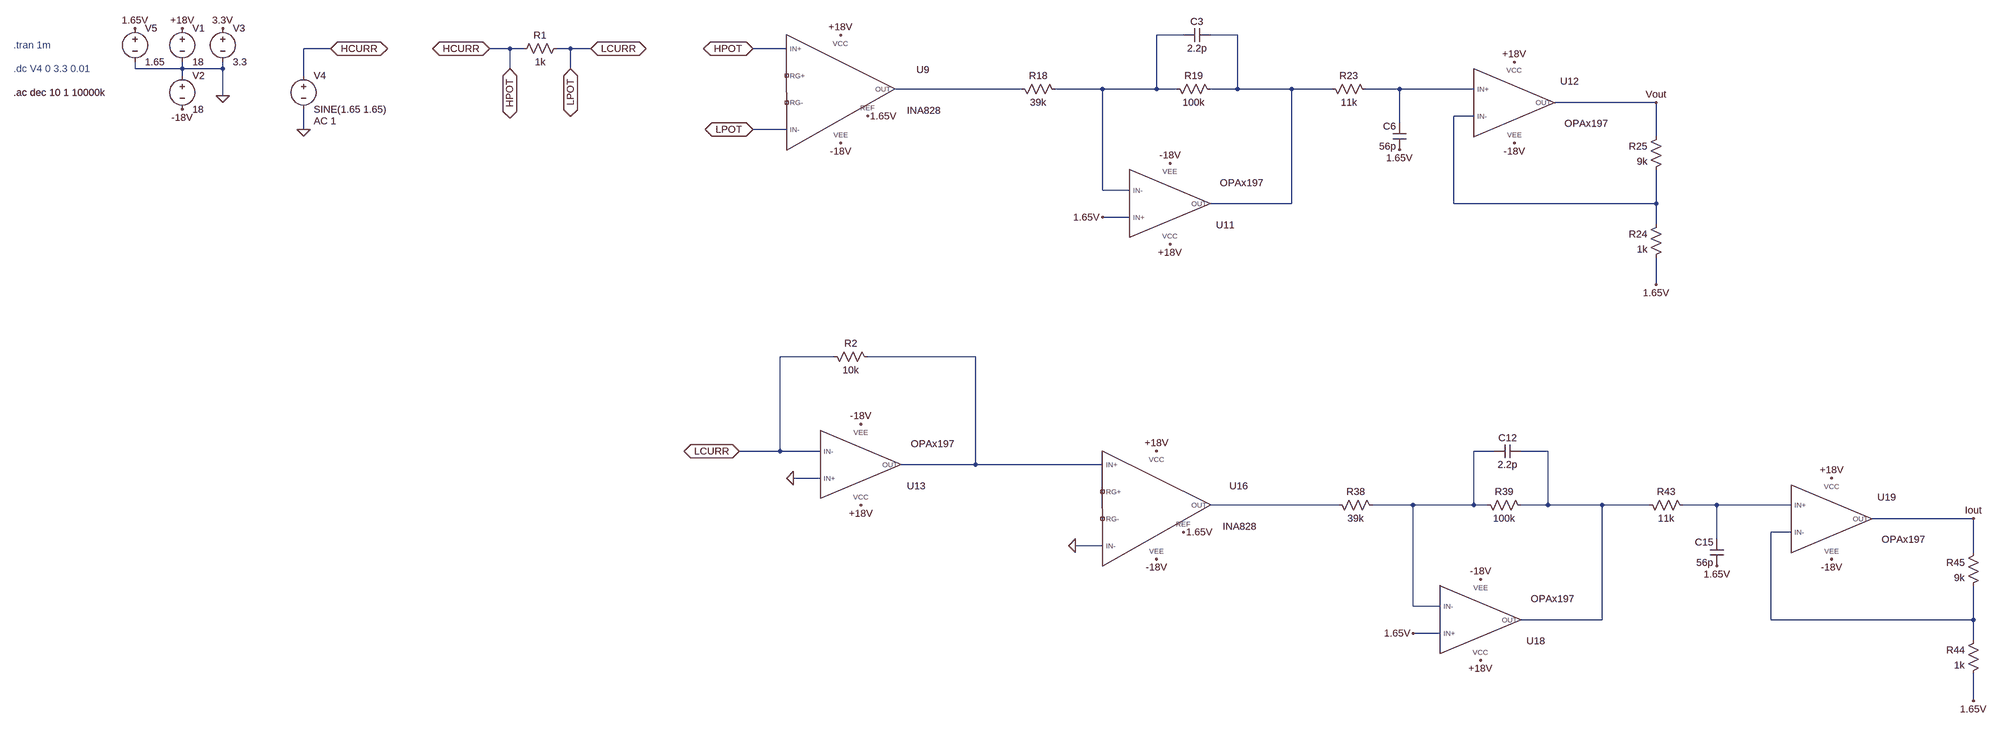
[diagram p0: schematic partial.asc]
partial.asc, the LTspice schematic file:
Version 4
SHEET 1 3644 5472
WIRE 1712 1344 1648 1344
WIRE 1840 1344 1776 1344
WIRE -448 1376 -512 1376
WIRE 112 1376 64 1376
WIRE 144 1376 112 1376
WIRE 256 1376 224 1376
WIRE 304 1376 256 1376
WIRE 768 1376 688 1376
WIRE -1088 1424 -1088 1408
WIRE -976 1424 -976 1408
WIRE -976 1424 -1088 1424
WIRE -880 1424 -880 1408
WIRE -880 1424 -976 1424
WIRE 112 1424 112 1376
WIRE 256 1424 256 1376
WIRE -976 1440 -976 1424
WIRE -512 1440 -512 1376
WIRE 1328 1472 1024 1472
WIRE 1520 1472 1408 1472
WIRE 1648 1472 1648 1344
WIRE 1648 1472 1520 1472
WIRE 1696 1472 1648 1472
WIRE 1840 1472 1840 1344
WIRE 1840 1472 1776 1472
WIRE 1968 1472 1840 1472
WIRE 2064 1472 1968 1472
WIRE 2224 1472 2144 1472
WIRE 2400 1472 2224 1472
WIRE -880 1488 -880 1424
WIRE 2832 1504 2592 1504
WIRE 2400 1536 2352 1536
WIRE 2224 1552 2224 1472
WIRE -512 1568 -512 1520
WIRE 768 1568 688 1568
WIRE 2832 1584 2832 1504
WIRE 1520 1712 1520 1472
WIRE 1584 1712 1520 1712
WIRE 1968 1744 1968 1472
WIRE 1968 1744 1776 1744
WIRE 2352 1744 2352 1536
WIRE 2832 1744 2832 1664
WIRE 2832 1744 2352 1744
WIRE 1584 1776 1520 1776
WIRE 2832 1792 2832 1744
WIRE 2832 1936 2832 1872
WIRE 880 2512 752 2512
WIRE 1216 2512 960 2512
WIRE 752 2736 752 2512
WIRE 752 2736 656 2736
WIRE 848 2736 752 2736
WIRE 2448 2736 2400 2736
WIRE 2576 2736 2512 2736
WIRE 1216 2768 1216 2512
WIRE 1216 2768 1040 2768
WIRE 1520 2768 1216 2768
WIRE 848 2800 784 2800
WIRE 2080 2864 1776 2864
WIRE 2256 2864 2160 2864
WIRE 2400 2864 2400 2736
WIRE 2400 2864 2256 2864
WIRE 2432 2864 2400 2864
WIRE 2576 2864 2576 2736
WIRE 2576 2864 2512 2864
WIRE 2704 2864 2576 2864
WIRE 2816 2864 2704 2864
WIRE 2976 2864 2896 2864
WIRE 3152 2864 2976 2864
WIRE 3584 2896 3344 2896
WIRE 3152 2928 3104 2928
WIRE 2976 2944 2976 2864
WIRE 1520 2960 1456 2960
WIRE 3584 2976 3584 2896
WIRE 2256 3104 2256 2864
WIRE 2320 3104 2256 3104
WIRE 2704 3136 2704 2864
WIRE 2704 3136 2512 3136
WIRE 3104 3136 3104 2928
WIRE 3584 3136 3584 3056
WIRE 3584 3136 3104 3136
WIRE 2320 3168 2256 3168
WIRE 3584 3184 3584 3136
WIRE 3584 3328 3584 3264
FLAG -880 1488 0
FLAG -976 1328 +18V
FLAG -976 1520 -18V
FLAG -880 1328 3.3V
FLAG -448 1376 HCURR
IOPIN -448 1376 BiDir
FLAG 688 1376 HPOT
IOPIN 688 1376 BiDir
FLAG 688 1568 LPOT
IOPIN 688 1568 BiDir
FLAG 896 1600 -18V
FLAG 896 1344 +18V
FLAG 112 1424 HPOT
IOPIN 112 1424 BiDir
FLAG 256 1424 LPOT
IOPIN 256 1424 BiDir
FLAG 1680 1840 +18V
FLAG 1680 1648 -18V
FLAG 1520 1776 1.65V
FLAG 2224 1616 1.65V
FLAG 2496 1408 +18V
FLAG 2496 1600 -18V
FLAG 2832 1504 Vout
FLAG 944 2864 +18V
FLAG 944 2672 -18V
FLAG 656 2736 LCURR
IOPIN 656 2736 BiDir
FLAG 304 1376 LCURR
IOPIN 304 1376 BiDir
FLAG 64 1376 HCURR
IOPIN 64 1376 BiDir
FLAG 1648 2992 -18V
FLAG 1648 2736 +18V
FLAG 2416 3232 +18V
FLAG 2416 3040 -18V
FLAG 2256 3168 1.65V
FLAG 2976 3008 1.65V
FLAG 3248 2800 +18V
FLAG 3248 2992 -18V
FLAG 3584 2896 Iout
FLAG 1712 2928 1.65V
FLAG 784 2800 0
FLAG -512 1568 0
FLAG -1088 1328 1.65V
FLAG 2832 1936 1.65V
FLAG 3584 3328 1.65V
FLAG 1456 2960 0
FLAG 960 1536 1.65V
SYMBOL voltage -976 1312 R0
WINDOW 123 0 0 Left 0
WINDOW 39 0 0 Left 0
SYMATTR InstName V1
SYMATTR Value 18
SYMBOL voltage -976 1424 R0
WINDOW 123 0 0 Left 0
WINDOW 39 0 0 Left 0
SYMATTR InstName V2
SYMATTR Value 18
SYMBOL voltage -880 1312 R0
WINDOW 123 0 0 Left 0
WINDOW 39 0 0 Left 0
SYMATTR InstName V3
SYMATTR Value 3.3
SYMBOL INA828 896 1472 R0
SYMATTR InstName U9
SYMBOL res 1312 1456 M90
WINDOW 0 0 56 VBottom 2
WINDOW 3 32 56 VTop 2
SYMATTR InstName R18
SYMATTR Value 39k
SYMBOL OPAx197 1680 1744 M180
SYMATTR InstName U11
SYMBOL res 1680 1456 M90
WINDOW 0 0 56 VBottom 2
WINDOW 3 32 56 VTop 2
SYMATTR InstName R19
SYMATTR Value 100k
SYMBOL cap 1712 1328 M90
WINDOW 0 0 32 VBottom 2
WINDOW 3 32 32 VTop 2
SYMATTR InstName C3
SYMATTR Value 2.2p
SYMBOL res 2048 1456 M90
WINDOW 0 0 56 VBottom 2
WINDOW 3 32 56 VTop 2
SYMATTR InstName R23
SYMATTR Value 11k
SYMBOL cap 2240 1552 M0
SYMATTR InstName C6
SYMATTR Value 56p
SYMBOL OPAx197 2496 1504 R0
SYMATTR InstName U12
SYMBOL res 2848 1776 M0
SYMATTR InstName R24
SYMATTR Value 1k
SYMBOL res 2848 1568 M0
SYMATTR InstName R25
SYMATTR Value 9k
SYMBOL OPAx197 944 2768 M180
SYMATTR InstName U13
SYMBOL INA828 1648 2864 R0
SYMATTR InstName U16
SYMBOL res 2064 2848 M90
WINDOW 0 0 56 VBottom 2
WINDOW 3 32 56 VTop 2
SYMATTR InstName R38
SYMATTR Value 39k
SYMBOL OPAx197 2416 3136 M180
SYMATTR InstName U18
SYMBOL res 2416 2848 M90
WINDOW 0 0 56 VBottom 2
WINDOW 3 32 56 VTop 2
SYMATTR InstName R39
SYMATTR Value 100k
SYMBOL cap 2448 2720 M90
WINDOW 0 0 32 VBottom 2
WINDOW 3 32 32 VTop 2
SYMATTR InstName C12
SYMATTR Value 2.2p
SYMBOL res 2800 2848 M90
WINDOW 0 0 56 VBottom 2
WINDOW 3 32 56 VTop 2
SYMATTR InstName R43
SYMATTR Value 11k
SYMBOL cap 2992 2944 M0
SYMATTR InstName C15
SYMATTR Value 56p
SYMBOL OPAx197 3248 2896 R0
SYMATTR InstName U19
SYMBOL res 3600 3168 M0
SYMATTR InstName R44
SYMATTR Value 1k
SYMBOL res 3600 2960 M0
SYMATTR InstName R45
SYMATTR Value 9k
SYMBOL voltage -512 1424 R0
WINDOW 123 24 124 Left 2
WINDOW 39 0 0 Left 0
SYMATTR InstName V4
SYMATTR Value SINE(1.65 1.65)
SYMATTR Value2 AC 1
SYMBOL voltage -1088 1312 R0
WINDOW 123 0 0 Left 0
WINDOW 39 0 0 Left 0
SYMATTR InstName V5
SYMATTR Value 1.65
SYMBOL res 240 1360 R90
WINDOW 0 0 56 VBottom 2
WINDOW 3 32 56 VTop 2
SYMATTR InstName R1
SYMATTR Value 1k
SYMBOL res 864 2496 M90
WINDOW 0 0 56 VBottom 2
WINDOW 3 32 56 VTop 2
SYMATTR InstName R2
SYMATTR Value 10k
TEXT -1376 1368 Left 2 ;.tran 1m
TEXT -1376 1424 Left 2 ;.dc V4 0 3.3 0.01
TEXT -1376 1480 Left 2 !.ac dec 10 1 10000k

The netlist it stands for:
* partial.asc
V1 +18V 0 18
V2 0 -18V 18
V3 3.3V 0 3.3
XU9 HPOT LCURR +18V -18V N003 1.65V NC_01 NC_02 INA828  ; pins IN+ IN- VCC VEE OUT REF RG+ RG-
R18 N003 N001 39k
XU11 1.65V N001 +18V -18V N002 OPAx197  ; pins IN+ IN- VCC VEE OUT
R19 N001 N002 100k
C3 N001 N002 2.2p
R23 N002 N004 11k
C6 N004 1.65V 56p
XU12 N004 N005 +18V -18V Vout OPAx197  ; pins IN+ IN- VCC VEE OUT
R24 N005 1.65V 1k
R25 Vout N005 9k
XU13 0 LCURR +18V -18V N006 OPAx197  ; pins IN+ IN- VCC VEE OUT
XU16 N006 0 +18V -18V N009 1.65V NC_03 NC_04 INA828  ; pins IN+ IN- VCC VEE OUT REF RG+ RG-
R38 N009 N007 39k
XU18 1.65V N007 +18V -18V N008 OPAx197  ; pins IN+ IN- VCC VEE OUT
R39 N007 N008 100k
C12 N007 N008 2.2p
R43 N008 N010 11k
C15 N010 1.65V 56p
XU19 N010 N011 +18V -18V Iout OPAx197  ; pins IN+ IN- VCC VEE OUT
R44 N011 1.65V 1k
R45 Iout N011 9k
V4 HPOT 0 SINE(1.65 1.65) AC 1
V5 1.65V 0 1.65
R1 LCURR HPOT 1k
R2 LCURR N006 10k
* .tran 1m
* .dc V4 0 3.3 0.01
.ac dec 10 1 10000k
.lib INA828.LIB
.lib OPAx197.LIB
.backanno
.end